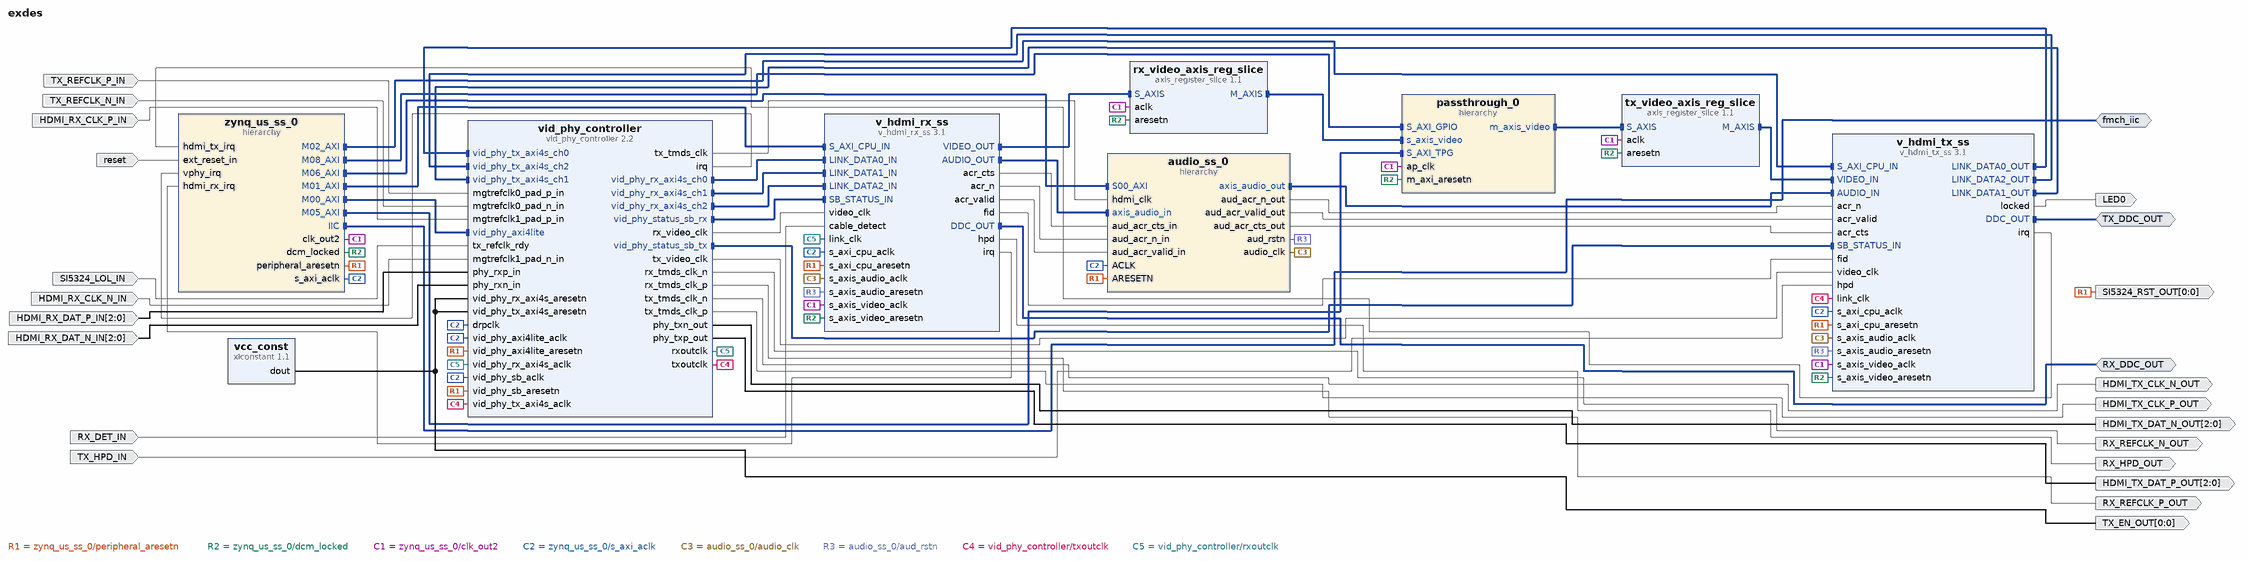
[diagram p0: block diagram of the top level]
# Vivado block design exdes, xczu9eg-ffvb1156-2-i-es2, Vivado 2018.2
create_bd_design exdes

create_bd_intf_port -mode Master -vlnv xilinx.com:interface:iic_rtl:1.0 fmch_iic
create_bd_intf_port -mode Master -vlnv xilinx.com:interface:iic_rtl:1.0 TX_DDC_OUT
create_bd_intf_port -mode Master -vlnv xilinx.com:interface:iic_rtl:1.0 RX_DDC_OUT
create_bd_port -dir I -type rst reset
set_property -dict {CONFIG.POLARITY ACTIVE_HIGH} [get_bd_ports reset]
create_bd_port -dir I TX_HPD_IN
create_bd_port -dir I TX_REFCLK_P_IN
create_bd_port -dir I TX_REFCLK_N_IN
create_bd_port -dir O HDMI_TX_CLK_P_OUT
create_bd_port -dir O HDMI_TX_CLK_N_OUT
create_bd_port -dir O -from 2 -to 0 HDMI_TX_DAT_P_OUT
create_bd_port -dir O -from 2 -to 0 HDMI_TX_DAT_N_OUT
create_bd_port -dir O -from 0 -to 0 TX_EN_OUT
create_bd_port -dir I RX_DET_IN
create_bd_port -dir I HDMI_RX_CLK_P_IN
create_bd_port -dir I HDMI_RX_CLK_N_IN
create_bd_port -dir I -from 2 -to 0 HDMI_RX_DAT_P_IN
create_bd_port -dir I -from 2 -to 0 HDMI_RX_DAT_N_IN
create_bd_port -dir O RX_HPD_OUT
create_bd_port -dir O RX_REFCLK_P_OUT
create_bd_port -dir O RX_REFCLK_N_OUT
create_bd_port -dir O -from 0 -to 0 SI5324_RST_OUT
create_bd_port -dir I SI5324_LOL_IN
create_bd_port -dir O LED0

create_bd_cell -type ip -vlnv xilinx.com:ip:vid_phy_controller:2.2 vid_phy_controller
set_property -dict [list \
  CONFIG.CHANNEL_SITE X0Y4 \
  CONFIG.C_Tx_Protocol HDMI \
  CONFIG.C_Rx_Protocol HDMI \
  CONFIG.C_TX_REFCLK_SEL 0 \
  CONFIG.C_RX_REFCLK_SEL 1 \
  CONFIG.C_TX_PLL_SELECTION 6 \
  CONFIG.C_RX_PLL_SELECTION 0 \
  CONFIG.C_NIDRU false \
  CONFIG.C_INPUT_PIXELS_PER_CLOCK 2 \
  CONFIG.C_Txrefclk_Rdy_Invert true \
  CONFIG.C_INT_HDMI_VER_CMPTBLE 3 \
] [get_bd_cells vid_phy_controller]
create_bd_cell -type ip -vlnv xilinx.com:ip:xlconstant:1.1 vcc_const
set_property -dict {CONFIG.CONST_VAL 1} [get_bd_cells vcc_const]
create_bd_cell -type ip -vlnv xilinx.com:ip:axis_register_slice:1.1 tx_video_axis_reg_slice
create_bd_cell -type ip -vlnv xilinx.com:ip:v_hdmi_tx_ss:3.1 v_hdmi_tx_ss
set_property -dict [list \
  CONFIG.C_INCLUDE_HDCP_1_4 false \
  CONFIG.C_INCLUDE_HDCP_2_2 false \
  CONFIG.C_MAX_BITS_PER_COMPONENT 8 \
  CONFIG.C_INPUT_PIXELS_PER_CLOCK 2 \
  CONFIG.C_HYSTERESIS_LEVEL 12 \
  CONFIG.C_ADDR_WIDTH 10 \
  CONFIG.C_INCLUDE_LOW_RESO_VID false \
  CONFIG.C_VID_INTERFACE 0 \
  CONFIG.C_INCLUDE_YUV420_SUP false \
  CONFIG.C_VALIDATION_ENABLE false \
  CONFIG.C_HDMI_FAST_SWITCH true \
  CONFIG.C_HPD_INVERT false \
  CONFIG.C_HDMI_VERSION 3 \
  CONFIG.C_ADD_MARK_DBG false \
] [get_bd_cells v_hdmi_tx_ss]
create_bd_cell -type ip -vlnv xilinx.com:ip:v_hdmi_rx_ss:3.1 v_hdmi_rx_ss
set_property -dict [list \
  CONFIG.C_INCLUDE_HDCP_1_4 false \
  CONFIG.C_INCLUDE_HDCP_2_2 false \
  CONFIG.C_MAX_BITS_PER_COMPONENT 8 \
  CONFIG.C_INPUT_PIXELS_PER_CLOCK 2 \
  CONFIG.C_EDID_RAM_SIZE 256 \
  CONFIG.C_ADDR_WIDTH 10 \
  CONFIG.C_INCLUDE_LOW_RESO_VID false \
  CONFIG.C_VID_INTERFACE 0 \
  CONFIG.C_INCLUDE_YUV420_SUP false \
  CONFIG.C_VALIDATION_ENABLE false \
  CONFIG.C_HDMI_FAST_SWITCH true \
  CONFIG.C_HPD_INVERT false \
  CONFIG.C_CD_INVERT true \
  CONFIG.C_EXDES_TOPOLOGY 0 \
  CONFIG.C_EXDES_TX_PLL_SELECTION 6 \
  CONFIG.C_EXDES_RX_PLL_SELECTION 0 \
  CONFIG.C_EXDES_NIDRU false \
  CONFIG.C_HDMI_VERSION 3 \
  CONFIG.C_ADD_MARK_DBG false \
  CONFIG.C_EXDES_AXILITE_FREQ 100 \
] [get_bd_cells v_hdmi_rx_ss]
create_bd_cell -type ip -vlnv xilinx.com:ip:axis_register_slice:1.1 rx_video_axis_reg_slice
create_bd_cell -type hier passthrough_0
create_bd_cell -type hier audio_ss_0
create_bd_cell -type hier zynq_us_ss_0

# ---- hierarchy /passthrough_0 ----
current_bd_instance /passthrough_0
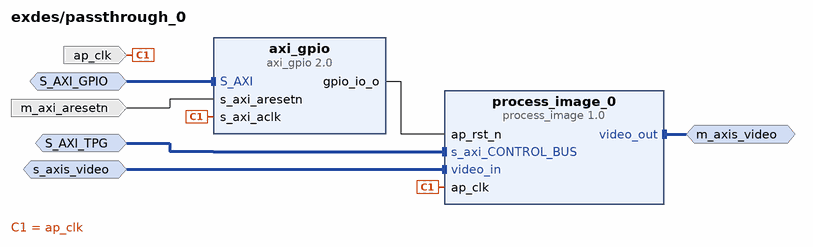
[diagram p1: block diagram inside /passthrough_0]
create_bd_intf_pin -mode Slave -vlnv xilinx.com:interface:aximm_rtl:1.0 S_AXI_TPG
create_bd_intf_pin -mode Slave -vlnv xilinx.com:interface:aximm_rtl:1.0 S_AXI_GPIO
create_bd_intf_pin -mode Slave -vlnv xilinx.com:interface:axis_rtl:1.0 s_axis_video
create_bd_intf_pin -mode Master -vlnv xilinx.com:interface:axis_rtl:1.0 m_axis_video
create_bd_pin -dir I -type clk ap_clk
create_bd_pin -dir I -type rst m_axi_aresetn

create_bd_cell -type ip -vlnv xilinx.com:ip:axi_gpio:2.0 axi_gpio
set_property -dict {CONFIG.C_GPIO_WIDTH 1 CONFIG.C_ALL_OUTPUTS 1} [get_bd_cells axi_gpio]
create_bd_cell -type ip -vlnv xilinx.com:hls:process_image:1.0 process_image_0

# ---- hierarchy /audio_ss_0 ----
current_bd_instance /audio_ss_0
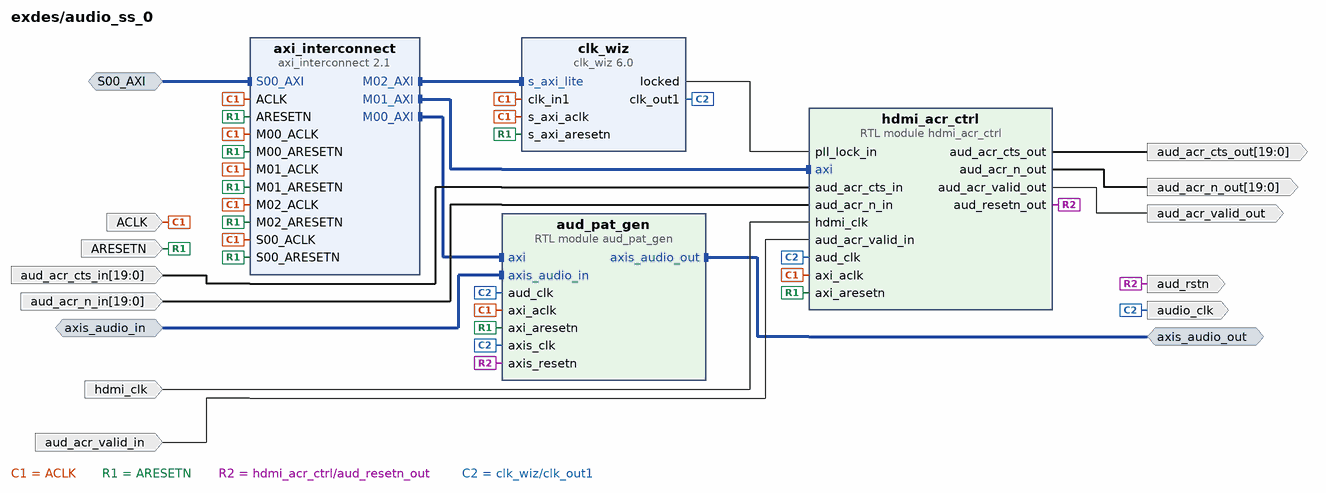
[diagram p2: block diagram inside /audio_ss_0]
create_bd_intf_pin -mode Slave -vlnv xilinx.com:interface:aximm_rtl:1.0 S00_AXI
create_bd_intf_pin -mode Slave -vlnv xilinx.com:interface:axis_rtl:1.0 axis_audio_in
create_bd_intf_pin -mode Master -vlnv xilinx.com:interface:axis_rtl:1.0 axis_audio_out
create_bd_pin -dir I -type clk ACLK
create_bd_pin -dir I -type rst ARESETN
create_bd_pin -dir I -type clk hdmi_clk
create_bd_pin -dir I -from 19 -to 0 aud_acr_cts_in
create_bd_pin -dir I -from 19 -to 0 aud_acr_n_in
create_bd_pin -dir I aud_acr_valid_in
create_bd_pin -dir O -from 19 -to 0 aud_acr_cts_out
create_bd_pin -dir O -from 19 -to 0 aud_acr_n_out
create_bd_pin -dir O aud_acr_valid_out
create_bd_pin -dir O -type rst aud_rstn
create_bd_pin -dir O -type clk audio_clk

create_bd_cell -type ip -vlnv xilinx.com:ip:axi_interconnect:2.1 axi_interconnect
set_property -dict {CONFIG.NUM_MI 3} [get_bd_cells axi_interconnect]
create_bd_cell -type ip -vlnv xilinx.com:ip:clk_wiz:6.0 clk_wiz
set_property -dict {CONFIG.USE_DYN_RECONFIG true CONFIG.PRIM_SOURCE No_buffer} [get_bd_cells clk_wiz]
create_bd_cell -type module -reference aud_pat_gen aud_pat_gen
create_bd_cell -type module -reference hdmi_acr_ctrl hdmi_acr_ctrl

# ---- hierarchy /zynq_us_ss_0 ----
current_bd_instance /zynq_us_ss_0
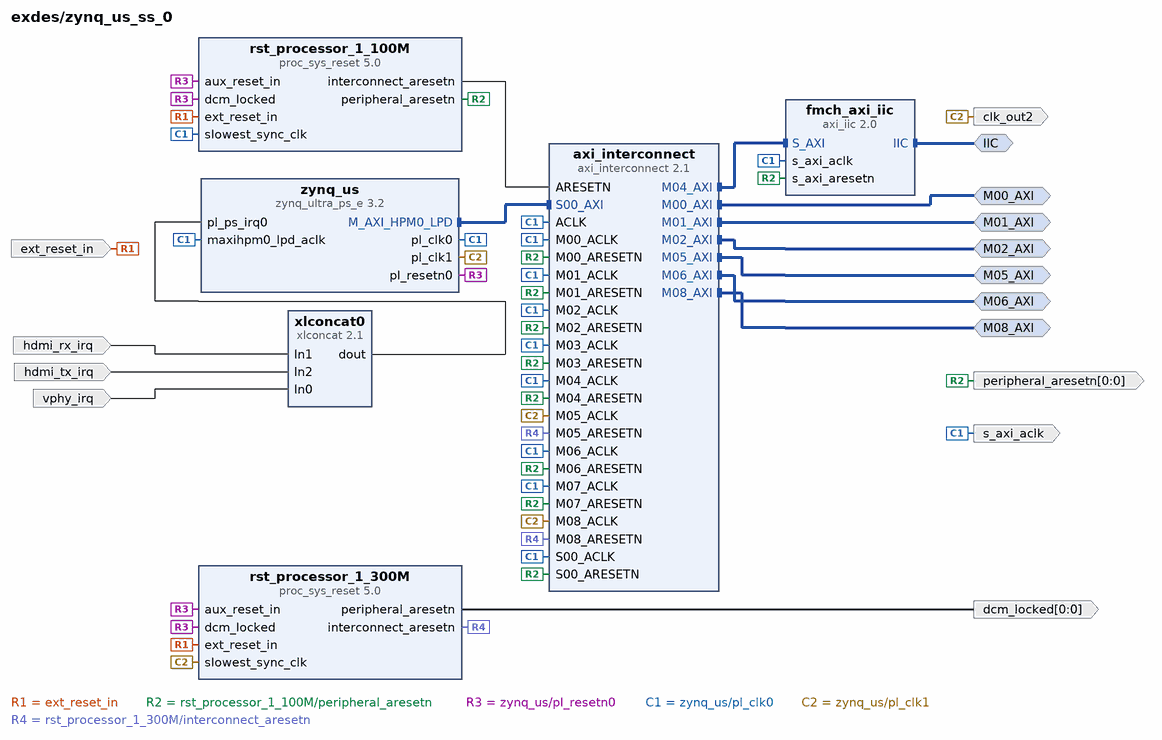
[diagram p3: block diagram inside /zynq_us_ss_0]
create_bd_intf_pin -mode Master -vlnv xilinx.com:interface:iic_rtl:1.0 IIC
create_bd_intf_pin -mode Master -vlnv xilinx.com:interface:aximm_rtl:1.0 M00_AXI
create_bd_intf_pin -mode Master -vlnv xilinx.com:interface:aximm_rtl:1.0 M01_AXI
create_bd_intf_pin -mode Master -vlnv xilinx.com:interface:aximm_rtl:1.0 M02_AXI
create_bd_intf_pin -mode Master -vlnv xilinx.com:interface:aximm_rtl:1.0 M05_AXI
create_bd_intf_pin -mode Master -vlnv xilinx.com:interface:aximm_rtl:1.0 M06_AXI
create_bd_intf_pin -mode Master -vlnv xilinx.com:interface:aximm_rtl:1.0 M08_AXI
create_bd_pin -dir I -type rst ext_reset_in
create_bd_pin -dir I hdmi_rx_irq
create_bd_pin -dir I hdmi_tx_irq
create_bd_pin -dir I vphy_irq
create_bd_pin -dir O -type clk clk_out2
create_bd_pin -dir O -from 0 -to 0 dcm_locked
create_bd_pin -dir O -from 0 -to 0 -type rst peripheral_aresetn
create_bd_pin -dir O -type clk s_axi_aclk

create_bd_cell -type ip -vlnv xilinx.com:ip:axi_interconnect:2.1 axi_interconnect
set_property -dict {CONFIG.NUM_MI 9} [get_bd_cells axi_interconnect]
create_bd_cell -type ip -vlnv xilinx.com:ip:xlconcat:2.1 xlconcat0
set_property -dict {CONFIG.NUM_PORTS 3} [get_bd_cells xlconcat0]
create_bd_cell -type ip -vlnv xilinx.com:ip:zynq_ultra_ps_e:3.2 zynq_us
set_property -dict [list \
  CONFIG.PSU__PSS_REF_CLK__FREQMHZ 33.330 \
  CONFIG.PSU__CAN1__PERIPHERAL__ENABLE 1 \
  CONFIG.PSU__CAN1__PERIPHERAL__IO {MIO 24 .. 25} \
  CONFIG.PSU__DPAUX__PERIPHERAL__ENABLE 1 \
  CONFIG.PSU__DPAUX__PERIPHERAL__IO {MIO 27 .. 30} \
  CONFIG.PSU__GEM__TSU__ENABLE 0 \
  CONFIG.PSU__FPGA_PL0_ENABLE 1 \
  CONFIG.PSU__FPGA_PL1_ENABLE 1 \
  CONFIG.PSU__ENET3__PERIPHERAL__ENABLE 1 \
  CONFIG.PSU__ENET3__FIFO__ENABLE 0 \
  CONFIG.PSU__ENET3__PTP__ENABLE 0 \
  CONFIG.PSU__ENET3__PERIPHERAL__IO {MIO 64 .. 75} \
  CONFIG.PSU__ENET3__GRP_MDIO__ENABLE 1 \
  CONFIG.PSU__ENET3__GRP_MDIO__IO {MIO 76 .. 77} \
  CONFIG.PSU__GPIO0_MIO__PERIPHERAL__ENABLE 1 \
  CONFIG.PSU__GPIO0_MIO__IO {MIO 0 .. 25} \
  CONFIG.PSU__GPIO1_MIO__PERIPHERAL__ENABLE 1 \
  CONFIG.PSU__GPIO1_MIO__IO {MIO 26 .. 51} \
  CONFIG.PSU__I2C0__PERIPHERAL__ENABLE 1 \
  CONFIG.PSU__I2C0__PERIPHERAL__IO {MIO 14 .. 15} \
  CONFIG.PSU__I2C1__PERIPHERAL__ENABLE 1 \
  CONFIG.PSU__I2C1__PERIPHERAL__IO {MIO 16 .. 17} \
  CONFIG.PSU__PCIE__PERIPHERAL__ENABLE 1 \
  CONFIG.PSU__PCIE__PERIPHERAL__ENDPOINT_ENABLE 0 \
  CONFIG.PSU__PCIE__PERIPHERAL__ROOTPORT_ENABLE 1 \
  CONFIG.PSU__PCIE__PERIPHERAL__ROOTPORT_IO {MIO 31} \
  CONFIG.PSU__PCIE__LANE0__ENABLE 1 \
  CONFIG.PSU__PCIE__LANE0__IO {GT Lane0} \
  CONFIG.PSU__GT__LINK_SPEED HBR \
  CONFIG.PSU__GT__VLT_SWNG_LVL_4 0 \
  CONFIG.PSU__GT__PRE_EMPH_LVL_4 0 \
  CONFIG.PSU__USB0__REF_CLK_SEL {Ref Clk2} \
  CONFIG.PSU__USB0__REF_CLK_FREQ 26 \
  CONFIG.PSU__DP__REF_CLK_SEL {Ref Clk3} \
  CONFIG.PSU__DP__REF_CLK_FREQ 27 \
  CONFIG.PSU__SATA__REF_CLK_SEL {Ref Clk1} \
  CONFIG.PSU__SATA__REF_CLK_FREQ 125 \
  CONFIG.PSU__PCIE__REF_CLK_SEL {Ref Clk0} \
  CONFIG.PSU__PCIE__REF_CLK_FREQ 100 \
  CONFIG.PSU__DP__LANE_SEL {Single Lower} \
  CONFIG.PSU__PCIE__DEVICE_PORT_TYPE {Root Port} \
  CONFIG.PSU__PCIE__MAXIMUM_LINK_WIDTH x1 \
  CONFIG.PSU__PCIE__LINK_SPEED {5.0 Gb/s} \
  CONFIG.PSU__PCIE__BAR0_VAL 0x0 \
  CONFIG.PSU__PCIE__BAR1_VAL 0x0 \
  CONFIG.PSU__PCIE__BAR2_VAL 0x0 \
  CONFIG.PSU__PCIE__BAR3_VAL 0x0 \
  CONFIG.PSU__PCIE__BAR4_VAL 0x0 \
  CONFIG.PSU__PCIE__BAR5_VAL 0x0 \
  CONFIG.PSU__PCIE__EROM_VAL 0x0 \
  CONFIG.PSU__PCIE__MAX_PAYLOAD_SIZE {256 bytes} \
  CONFIG.PSU__PCIE__VENDOR_ID 0x10EE \
  CONFIG.PSU__PCIE__DEVICE_ID 0xD021 \
  CONFIG.PSU__PCIE__REVISION_ID 0x0 \
  CONFIG.PSU__PCIE__SUBSYSTEM_VENDOR_ID 0x10EE \
  CONFIG.PSU__PCIE__SUBSYSTEM_ID 0x7 \
  CONFIG.PSU__PCIE__CLASS_CODE_BASE 0x06 \
  CONFIG.PSU__PCIE__CLASS_CODE_SUB 0x4 \
  CONFIG.PSU__PCIE__CLASS_CODE_INTERFACE 0x0 \
  CONFIG.PSU__PCIE__CLASS_CODE_VALUE 0x60400 \
  CONFIG.PSU__PCIE__CRS_SW_VISIBILITY 1 \
  CONFIG.SUBPRESET1 Custom \
  CONFIG.PSU__PMU__AIBACK__ENABLE 0 \
  CONFIG.PSU__PMU__PLERROR__ENABLE 0 \
  CONFIG.PSU__PMU__PERIPHERAL__ENABLE 1 \
  CONFIG.PSU__PMU__EMIO_GPI__ENABLE 0 \
  CONFIG.PSU__PMU__EMIO_GPO__ENABLE 0 \
  CONFIG.PSU__PMU__GPI0__ENABLE 0 \
  CONFIG.PSU__PMU__GPI1__ENABLE 0 \
  CONFIG.PSU__PMU__GPI2__ENABLE 0 \
  CONFIG.PSU__PMU__GPI3__ENABLE 0 \
  CONFIG.PSU__PMU__GPI4__ENABLE 0 \
  CONFIG.PSU__PMU__GPI5__ENABLE 0 \
  CONFIG.PSU__PMU__GPO0__ENABLE 1 \
  CONFIG.PSU__PMU__GPO1__ENABLE 1 \
  CONFIG.PSU__PMU__GPO2__ENABLE 1 \
  CONFIG.PSU__PMU__GPO3__ENABLE 1 \
  CONFIG.PSU__PMU__GPO4__ENABLE 1 \
  CONFIG.PSU__PMU__GPO5__ENABLE 1 \
  CONFIG.PSU__PMU__GPO0__IO {MIO 32} \
  CONFIG.PSU__PMU__GPO1__IO {MIO 33} \
  CONFIG.PSU__PMU__GPO2__IO {MIO 34} \
  CONFIG.PSU__PMU__GPO3__IO {MIO 35} \
  CONFIG.PSU__PMU__GPO4__IO {MIO 36} \
  CONFIG.PSU__PMU__GPO5__IO {MIO 37} \
  CONFIG.PSU__PMU__GPO2__POLARITY low \
  CONFIG.PSU__PMU__GPO3__POLARITY low \
  CONFIG.PSU__PMU__GPO4__POLARITY low \
  CONFIG.PSU__PMU__GPO5__POLARITY low \
  CONFIG.PSU__QSPI__PERIPHERAL__ENABLE 1 \
  CONFIG.PSU__QSPI__PERIPHERAL__IO {MIO 0 .. 12} \
  CONFIG.PSU__QSPI__PERIPHERAL__MODE {Dual Parallel} \
  CONFIG.PSU__QSPI__PERIPHERAL__DATA_MODE x4 \
  CONFIG.PSU__QSPI__GRP_FBCLK__ENABLE 1 \
  CONFIG.PSU__QSPI__GRP_FBCLK__IO {MIO 6} \
  CONFIG.PSU__SD1__PERIPHERAL__ENABLE 1 \
  CONFIG.PSU__SD1__PERIPHERAL__IO {MIO 39 .. 51} \
  CONFIG.PSU__SD1__GRP_CD__ENABLE 1 \
  CONFIG.PSU__SD1__GRP_CD__IO {MIO 45} \
  CONFIG.PSU__SD1__GRP_POW__ENABLE 1 \
  CONFIG.PSU__SD1__GRP_POW__IO {MIO 43} \
  CONFIG.PSU__SD1__GRP_WP__ENABLE 1 \
  CONFIG.PSU__SD1__GRP_WP__IO {MIO 44} \
  CONFIG.PSU__SD1__SLOT_TYPE {SD 3.0} \
  CONFIG.PSU__SD1__DATA_TRANSFER_MODE 8Bit \
  CONFIG.PSU__SWDT0__PERIPHERAL__ENABLE 1 \
  CONFIG.PSU__SWDT0__CLOCK__ENABLE 0 \
  CONFIG.PSU__SWDT0__RESET__ENABLE 0 \
  CONFIG.PSU__SWDT1__PERIPHERAL__ENABLE 1 \
  CONFIG.PSU__SWDT1__CLOCK__ENABLE 0 \
  CONFIG.PSU__SWDT1__RESET__ENABLE 0 \
  CONFIG.PSU__UART0__BAUD_RATE 115200 \
  CONFIG.PSU__TTC0__PERIPHERAL__ENABLE 1 \
  CONFIG.PSU__TTC0__CLOCK__ENABLE 0 \
  CONFIG.PSU__TTC0__WAVEOUT__ENABLE 0 \
  CONFIG.PSU__TTC1__PERIPHERAL__ENABLE 1 \
  CONFIG.PSU__UART1__BAUD_RATE 115200 \
  CONFIG.PSU__TTC1__CLOCK__ENABLE 0 \
  CONFIG.PSU__TTC1__WAVEOUT__ENABLE 0 \
  CONFIG.PSU__TTC2__PERIPHERAL__ENABLE 1 \
  CONFIG.PSU__TTC2__CLOCK__ENABLE 0 \
  CONFIG.PSU__TTC2__WAVEOUT__ENABLE 0 \
  CONFIG.PSU__TTC3__PERIPHERAL__ENABLE 1 \
  CONFIG.PSU__TTC3__CLOCK__ENABLE 0 \
  CONFIG.PSU__TTC3__WAVEOUT__ENABLE 0 \
  CONFIG.PSU__CSUPMU__PERIPHERAL__VALID 1 \
  CONFIG.PSU__DDRC__BUS_WIDTH {64 Bit} \
  CONFIG.PSU__DDRC__DEVICE_CAPACITY {4096 MBits} \
  CONFIG.PSU__DDRC__DRAM_WIDTH {8 Bits} \
  CONFIG.PSU__DDRC__ECC Disabled \
  CONFIG.PSU__DDRC__MEMORY_TYPE {DDR 4} \
  CONFIG.PSU__DDRC__SPEED_BIN DDR4_2133P \
  CONFIG.PSU__DDRC__COMPONENTS UDIMM \
  CONFIG.PSU__UART0__PERIPHERAL__ENABLE 1 \
  CONFIG.PSU__UART0__PERIPHERAL__IO {MIO 18 .. 19} \
  CONFIG.PSU__UART0__MODEM__ENABLE 0 \
  CONFIG.PSU__UART1__PERIPHERAL__ENABLE 1 \
  CONFIG.PSU__UART1__PERIPHERAL__IO {MIO 20 .. 21} \
  CONFIG.PSU__UART1__MODEM__ENABLE 0 \
  CONFIG.PSU__USB0__PERIPHERAL__ENABLE 1 \
  CONFIG.PSU__USB0__PERIPHERAL__IO {MIO 52 .. 63} \
  CONFIG.PSU__USB3_0__PERIPHERAL__ENABLE 1 \
  CONFIG.PSU__USB3_0__PERIPHERAL__IO {GT Lane2} \
  CONFIG.PSU__USB3_0__EMIO__ENABLE 0 \
  CONFIG.PSU__USB2_0__EMIO__ENABLE 0 \
  CONFIG.PSU__USE__M_AXI_GP0 0 \
  CONFIG.PSU__USE__M_AXI_GP1 0 \
  CONFIG.PSU__USE__M_AXI_GP2 1 \
  CONFIG.PSU__USE__IRQ0 1 \
  CONFIG.PSU__USE__IRQ1 1 \
  CONFIG.PSU__DDR_HIGH_ADDRESS_GUI_ENABLE 1 \
  CONFIG.PSU_BANK_0_IO_STANDARD LVCMOS18 \
  CONFIG.PSU_BANK_1_IO_STANDARD LVCMOS18 \
  CONFIG.PSU_BANK_2_IO_STANDARD LVCMOS18 \
  CONFIG.PSU__DISPLAYPORT__PERIPHERAL__ENABLE 1 \
  CONFIG.PSU__DISPLAYPORT__LANE0__ENABLE 1 \
  CONFIG.PSU__DISPLAYPORT__LANE0__IO {GT Lane1} \
  CONFIG.PSU__DISPLAYPORT__LANE1__ENABLE 0 \
  CONFIG.PSU__SATA__PERIPHERAL__ENABLE 1 \
  CONFIG.PSU__SATA__LANE1__IO {GT Lane3} \
  CONFIG.PSU__CRL_APB__USB3__ENABLE 1 \
  CONFIG.PSU__CRF_APB__APLL_CTRL__SRCSEL PSS_REF_CLK \
  CONFIG.PSU__CRF_APB__DPLL_CTRL__SRCSEL PSS_REF_CLK \
  CONFIG.PSU__CRF_APB__VPLL_CTRL__SRCSEL PSS_REF_CLK \
  CONFIG.PSU__CRF_APB__ACPU_CTRL__SRCSEL APLL \
  CONFIG.PSU__CRF_APB__DBG_TRACE_CTRL__SRCSEL IOPLL \
  CONFIG.PSU__CRF_APB__DBG_FPD_CTRL__SRCSEL IOPLL \
  CONFIG.PSU__CRF_APB__DP_VIDEO_REF_CTRL__SRCSEL VPLL \
  CONFIG.PSU__CRF_APB__DP_AUDIO_REF_CTRL__SRCSEL RPLL \
  CONFIG.PSU__CRF_APB__DP_STC_REF_CTRL__SRCSEL RPLL \
  CONFIG.PSU__CRF_APB__DDR_CTRL__SRCSEL DPLL \
  CONFIG.PSU__CRF_APB__GPU_REF_CTRL__SRCSEL IOPLL \
  CONFIG.PSU__CRL_APB__PL0_REF_CTRL__SRCSEL RPLL \
  CONFIG.PSU__CRF_APB__GDMA_REF_CTRL__SRCSEL APLL \
  CONFIG.PSU__CRF_APB__DPDMA_REF_CTRL__SRCSEL APLL \
  CONFIG.PSU__CRF_APB__TOPSW_MAIN_CTRL__SRCSEL DPLL \
  CONFIG.PSU__CRF_APB__TOPSW_LSBUS_CTRL__SRCSEL IOPLL \
  CONFIG.PSU__CRF_APB__DBG_TSTMP_CTRL__SRCSEL IOPLL \
  CONFIG.PSU__CRL_APB__IOPLL_CTRL__SRCSEL PSS_REF_CLK \
  CONFIG.PSU__CRL_APB__RPLL_CTRL__SRCSEL PSS_REF_CLK \
  CONFIG.PSU__CRL_APB__GEM3_REF_CTRL__SRCSEL IOPLL \
  CONFIG.PSU__CRL_APB__USB0_BUS_REF_CTRL__SRCSEL IOPLL \
  CONFIG.PSU__CRL_APB__QSPI_REF_CTRL__SRCSEL IOPLL \
  CONFIG.PSU__CRL_APB__SDIO1_REF_CTRL__SRCSEL IOPLL \
  CONFIG.PSU__CRL_APB__UART0_REF_CTRL__SRCSEL IOPLL \
  CONFIG.PSU__CRL_APB__UART1_REF_CTRL__SRCSEL IOPLL \
  CONFIG.PSU__CRL_APB__I2C0_REF_CTRL__SRCSEL IOPLL \
  CONFIG.PSU__CRL_APB__I2C1_REF_CTRL__SRCSEL IOPLL \
  CONFIG.PSU__CRL_APB__CAN1_REF_CTRL__SRCSEL IOPLL \
  CONFIG.PSU__CRL_APB__CPU_R5_CTRL__SRCSEL RPLL \
  CONFIG.PSU__CRL_APB__IOU_SWITCH_CTRL__SRCSEL IOPLL \
  CONFIG.PSU__CRL_APB__PCAP_CTRL__SRCSEL IOPLL \
  CONFIG.PSU__CRL_APB__LPD_LSBUS_CTRL__SRCSEL IOPLL \
  CONFIG.PSU__CRL_APB__LPD_SWITCH_CTRL__SRCSEL IOPLL \
  CONFIG.PSU__CRL_APB__DBG_LPD_CTRL__SRCSEL IOPLL \
  CONFIG.PSU__CRL_APB__ADMA_REF_CTRL__SRCSEL IOPLL \
  CONFIG.PSU__CRL_APB__TIMESTAMP_REF_CTRL__SRCSEL IOPLL \
  CONFIG.PSU__CRL_APB__USB3_DUAL_REF_CTRL__SRCSEL IOPLL \
  CONFIG.PSU__IOU_SLCR__IOU_TTC_APB_CLK__TTC0_SEL APB \
  CONFIG.PSU__IOU_SLCR__IOU_TTC_APB_CLK__TTC1_SEL APB \
  CONFIG.PSU__IOU_SLCR__IOU_TTC_APB_CLK__TTC2_SEL APB \
  CONFIG.PSU__IOU_SLCR__IOU_TTC_APB_CLK__TTC3_SEL APB \
  CONFIG.PSU__OVERRIDE__BASIC_CLOCK 0 \
  CONFIG.PSU__DLL__ISUSED 1 \
  CONFIG.PSU__DDR__INTERFACE__FREQMHZ 533.500 \
  CONFIG.PSU__CRF_APB__ACPU_CTRL__FREQMHZ 1200 \
  CONFIG.PSU__CRF_APB__DBG_TRACE_CTRL__FREQMHZ 250 \
  CONFIG.PSU__CRF_APB__DBG_FPD_CTRL__FREQMHZ 250 \
  CONFIG.PSU__CRF_APB__DDR_CTRL__FREQMHZ 1067 \
  CONFIG.PSU__CRF_APB__GPU_REF_CTRL__FREQMHZ 500 \
  CONFIG.PSU__CRL_APB__PL0_REF_CTRL__FREQMHZ 100 \
  CONFIG.PSU__CRF_APB__GDMA_REF_CTRL__FREQMHZ 600 \
  CONFIG.PSU__CRF_APB__DPDMA_REF_CTRL__FREQMHZ 600 \
  CONFIG.PSU__CRF_APB__TOPSW_MAIN_CTRL__FREQMHZ 533.33 \
  CONFIG.PSU__CRF_APB__TOPSW_LSBUS_CTRL__FREQMHZ 100 \
  CONFIG.PSU__CRF_APB__DBG_TSTMP_CTRL__FREQMHZ 250 \
  CONFIG.PSU__CRL_APB__GEM3_REF_CTRL__FREQMHZ 125 \
  CONFIG.PSU__CRL_APB__USB0_BUS_REF_CTRL__FREQMHZ 250 \
  CONFIG.PSU__CRL_APB__QSPI_REF_CTRL__FREQMHZ 125 \
  CONFIG.PSU__CRL_APB__SDIO1_REF_CTRL__FREQMHZ 200 \
  CONFIG.PSU__CRL_APB__UART0_REF_CTRL__FREQMHZ 100 \
  CONFIG.PSU__CRL_APB__UART1_REF_CTRL__FREQMHZ 100 \
  CONFIG.PSU__CRL_APB__I2C0_REF_CTRL__FREQMHZ 100 \
  CONFIG.PSU__CRL_APB__I2C1_REF_CTRL__FREQMHZ 100 \
  CONFIG.PSU__CRL_APB__CAN1_REF_CTRL__FREQMHZ 100 \
  CONFIG.PSU__CRL_APB__CPU_R5_CTRL__FREQMHZ 500 \
  CONFIG.PSU__CRL_APB__IOU_SWITCH_CTRL__FREQMHZ 250 \
  CONFIG.PSU__CRL_APB__PCAP_CTRL__FREQMHZ 200 \
  CONFIG.PSU__CRL_APB__LPD_LSBUS_CTRL__FREQMHZ 100 \
  CONFIG.PSU__CRL_APB__LPD_SWITCH_CTRL__FREQMHZ 500 \
  CONFIG.PSU__CRL_APB__DBG_LPD_CTRL__FREQMHZ 250 \
  CONFIG.PSU__CRL_APB__ADMA_REF_CTRL__FREQMHZ 500 \
  CONFIG.PSU__CRL_APB__TIMESTAMP_REF_CTRL__FREQMHZ 100 \
  CONFIG.PSU__CRL_APB__USB3_DUAL_REF_CTRL__FREQMHZ 20 \
  CONFIG.PSU__PMU_COHERENCY 0 \
  CONFIG.PSU__USB0_COHERENCY 0 \
  CONFIG.PSU__SD1_COHERENCY 0 \
  CONFIG.PSU__QSPI_COHERENCY 0 \
  CONFIG.PSU__ENET3__TSU__ENABLE 0 \
  CONFIG.PSU__GEM3_COHERENCY 0 \
] [get_bd_cells zynq_us]
# 103 more settings of zynq_us are not shown: defaults, MIO pin electricals, DDR timing, and values the tool derives
create_bd_cell -type ip -vlnv xilinx.com:ip:axi_iic:2.0 fmch_axi_iic
set_property -dict {CONFIG.USE_BOARD_FLOW true CONFIG.IIC_BOARD_INTERFACE Custom} [get_bd_cells fmch_axi_iic]
create_bd_cell -type ip -vlnv xilinx.com:ip:proc_sys_reset:5.0 rst_processor_1_100M
set_property -dict {CONFIG.USE_BOARD_FLOW true CONFIG.RESET_BOARD_INTERFACE reset} [get_bd_cells rst_processor_1_100M]
create_bd_cell -type ip -vlnv xilinx.com:ip:proc_sys_reset:5.0 rst_processor_1_300M
set_property -dict {CONFIG.USE_BOARD_FLOW true CONFIG.RESET_BOARD_INTERFACE reset} [get_bd_cells rst_processor_1_300M]

# ---- connections ----

current_bd_instance /passthrough_0
connect_bd_intf_net [get_bd_intf_pins S_AXI_TPG] [get_bd_intf_pins process_image_0/s_axi_CONTROL_BUS]
connect_bd_intf_net -intf_net intf_net_bdry_in_S_AXI_GPIO [get_bd_intf_pins S_AXI_GPIO] [get_bd_intf_pins axi_gpio/S_AXI]
connect_bd_intf_net [get_bd_intf_pins s_axis_video] [get_bd_intf_pins process_image_0/video_in]
connect_bd_intf_net [get_bd_intf_pins m_axis_video] [get_bd_intf_pins process_image_0/video_out]
connect_bd_net -net net_bdry_in_ap_clk [get_bd_pins ap_clk] [get_bd_pins axi_gpio/s_axi_aclk] [get_bd_pins process_image_0/ap_clk]
connect_bd_net -net net_bdry_in_m_axi_aresetn [get_bd_pins m_axi_aresetn] [get_bd_pins axi_gpio/s_axi_aresetn]
connect_bd_net -net net_axi_gpio_gpio_io_o [get_bd_pins axi_gpio/gpio_io_o] [get_bd_pins process_image_0/ap_rst_n]

current_bd_instance /audio_ss_0
connect_bd_intf_net -intf_net intf_net_axi_interconnect_M00_AXI [get_bd_intf_pins axi_interconnect/M00_AXI] [get_bd_intf_pins aud_pat_gen/axi]
connect_bd_intf_net -intf_net intf_net_axi_interconnect_M01_AXI [get_bd_intf_pins axi_interconnect/M01_AXI] [get_bd_intf_pins hdmi_acr_ctrl/axi]
connect_bd_intf_net -intf_net intf_net_axi_interconnect_M02_AXI [get_bd_intf_pins axi_interconnect/M02_AXI] [get_bd_intf_pins clk_wiz/s_axi_lite]
connect_bd_intf_net -intf_net intf_net_bdry_in_S00_AXI [get_bd_intf_pins S00_AXI] [get_bd_intf_pins axi_interconnect/S00_AXI]
connect_bd_intf_net -intf_net intf_net_bdry_in_axis_audio_in [get_bd_intf_pins axis_audio_in] [get_bd_intf_pins aud_pat_gen/axis_audio_in]
connect_bd_intf_net -intf_net intf_net_aud_pat_gen_axis_audio_out [get_bd_intf_pins axis_audio_out] [get_bd_intf_pins aud_pat_gen/axis_audio_out]
connect_bd_net -net net_bdry_in_ACLK [get_bd_pins ACLK] \
  [get_bd_pins axi_interconnect/ACLK] [get_bd_pins aud_pat_gen/axi_aclk] [get_bd_pins hdmi_acr_ctrl/axi_aclk] \
  [get_bd_pins clk_wiz/s_axi_aclk] [get_bd_pins clk_wiz/clk_in1] [get_bd_pins axi_interconnect/S00_ACLK] \
  [get_bd_pins axi_interconnect/M00_ACLK] [get_bd_pins axi_interconnect/M01_ACLK] [get_bd_pins axi_interconnect/M02_ACLK]
connect_bd_net -net net_bdry_in_aud_acr_cts_in [get_bd_pins aud_acr_cts_in] [get_bd_pins hdmi_acr_ctrl/aud_acr_cts_in]
connect_bd_net -net net_bdry_in_aud_acr_n_in [get_bd_pins aud_acr_n_in] [get_bd_pins hdmi_acr_ctrl/aud_acr_n_in]
connect_bd_net -net net_bdry_in_hdmi_clk [get_bd_pins hdmi_clk] [get_bd_pins hdmi_acr_ctrl/hdmi_clk]
connect_bd_net -net net_bdry_in_aud_acr_valid_in [get_bd_pins aud_acr_valid_in] [get_bd_pins hdmi_acr_ctrl/aud_acr_valid_in]
connect_bd_net -net net_bdry_in_ARESETN [get_bd_pins ARESETN] \
  [get_bd_pins axi_interconnect/ARESETN] [get_bd_pins aud_pat_gen/axi_aresetn] [get_bd_pins hdmi_acr_ctrl/axi_aresetn] \
  [get_bd_pins clk_wiz/s_axi_aresetn] [get_bd_pins axi_interconnect/S00_ARESETN] [get_bd_pins axi_interconnect/M00_ARESETN] \
  [get_bd_pins axi_interconnect/M01_ARESETN] [get_bd_pins axi_interconnect/M02_ARESETN]
connect_bd_net -net net_hdmi_acr_ctrl_aud_acr_cts_out [get_bd_pins hdmi_acr_ctrl/aud_acr_cts_out] [get_bd_pins aud_acr_cts_out]
connect_bd_net -net net_hdmi_acr_ctrl_aud_acr_n_out [get_bd_pins hdmi_acr_ctrl/aud_acr_n_out] [get_bd_pins aud_acr_n_out]
connect_bd_net -net net_hdmi_acr_ctrl_aud_acr_valid_out [get_bd_pins hdmi_acr_ctrl/aud_acr_valid_out] [get_bd_pins aud_acr_valid_out]
connect_bd_net -net net_hdmi_acr_ctrl_aud_resetn_out [get_bd_pins hdmi_acr_ctrl/aud_resetn_out] \
  [get_bd_pins aud_rstn] [get_bd_pins aud_pat_gen/axis_resetn]
connect_bd_net -net net_clk_wiz_clk_out1 [get_bd_pins clk_wiz/clk_out1] \
  [get_bd_pins audio_clk] [get_bd_pins aud_pat_gen/axis_clk] [get_bd_pins aud_pat_gen/aud_clk] \
  [get_bd_pins hdmi_acr_ctrl/aud_clk]
connect_bd_net -net net_clk_wiz_locked [get_bd_pins clk_wiz/locked] [get_bd_pins hdmi_acr_ctrl/pll_lock_in]

current_bd_instance /zynq_us_ss_0
connect_bd_intf_net -intf_net intf_net_zynq_us_M_AXI_HPM0_LPD [get_bd_intf_pins zynq_us/M_AXI_HPM0_LPD] [get_bd_intf_pins axi_interconnect/S00_AXI]
connect_bd_intf_net -intf_net intf_net_axi_interconnect_M04_AXI [get_bd_intf_pins axi_interconnect/M04_AXI] [get_bd_intf_pins fmch_axi_iic/S_AXI]
connect_bd_intf_net -intf_net intf_net_fmch_axi_iic_IIC [get_bd_intf_pins IIC] [get_bd_intf_pins fmch_axi_iic/IIC]
connect_bd_intf_net -intf_net intf_net_axi_interconnect_M00_AXI [get_bd_intf_pins M00_AXI] [get_bd_intf_pins axi_interconnect/M00_AXI]
connect_bd_intf_net -intf_net intf_net_axi_interconnect_M01_AXI [get_bd_intf_pins M01_AXI] [get_bd_intf_pins axi_interconnect/M01_AXI]
connect_bd_intf_net -intf_net intf_net_axi_interconnect_M02_AXI [get_bd_intf_pins M02_AXI] [get_bd_intf_pins axi_interconnect/M02_AXI]
connect_bd_intf_net -intf_net intf_net_axi_interconnect_M05_AXI [get_bd_intf_pins M05_AXI] [get_bd_intf_pins axi_interconnect/M05_AXI]
connect_bd_intf_net -intf_net intf_net_axi_interconnect_M06_AXI [get_bd_intf_pins M06_AXI] [get_bd_intf_pins axi_interconnect/M06_AXI]
connect_bd_intf_net -intf_net intf_net_axi_interconnect_M08_AXI [get_bd_intf_pins M08_AXI] [get_bd_intf_pins axi_interconnect/M08_AXI]
connect_bd_net -net net_bdry_in_ext_reset_in [get_bd_pins ext_reset_in] \
  [get_bd_pins rst_processor_1_100M/ext_reset_in] [get_bd_pins rst_processor_1_300M/ext_reset_in]
connect_bd_net -net net_bdry_in_hdmi_rx_irq [get_bd_pins hdmi_rx_irq] [get_bd_pins xlconcat0/In1]
connect_bd_net -net net_bdry_in_hdmi_tx_irq [get_bd_pins hdmi_tx_irq] [get_bd_pins xlconcat0/In2]
connect_bd_net -net net_bdry_in_vphy_irq [get_bd_pins vphy_irq] [get_bd_pins xlconcat0/In0]
connect_bd_net -net net_xlconcat0_dout [get_bd_pins xlconcat0/dout] [get_bd_pins zynq_us/pl_ps_irq0]
connect_bd_net -net net_rst_processor_1_100M_interconnect_aresetn [get_bd_pins rst_processor_1_100M/interconnect_aresetn] \
  [get_bd_pins axi_interconnect/ARESETN]
connect_bd_net -net net_rst_processor_1_100M_peripheral_aresetn [get_bd_pins rst_processor_1_100M/peripheral_aresetn] \
  [get_bd_pins fmch_axi_iic/s_axi_aresetn] [get_bd_pins axi_interconnect/S00_ARESETN] [get_bd_pins peripheral_aresetn] \
  [get_bd_pins axi_interconnect/M00_ARESETN] [get_bd_pins axi_interconnect/M01_ARESETN] \
  [get_bd_pins axi_interconnect/M02_ARESETN] [get_bd_pins axi_interconnect/M03_ARESETN] \
  [get_bd_pins axi_interconnect/M04_ARESETN] [get_bd_pins axi_interconnect/M06_ARESETN] \
  [get_bd_pins axi_interconnect/M07_ARESETN]
connect_bd_net -net net_zynq_us_pl_resetn0 [get_bd_pins zynq_us/pl_resetn0] \
  [get_bd_pins rst_processor_1_100M/aux_reset_in] [get_bd_pins rst_processor_1_100M/dcm_locked] \
  [get_bd_pins rst_processor_1_300M/aux_reset_in] [get_bd_pins rst_processor_1_300M/dcm_locked]
connect_bd_net -net net_zynq_us_pl_clk0 [get_bd_pins zynq_us/pl_clk0] \
  [get_bd_pins rst_processor_1_100M/slowest_sync_clk] [get_bd_pins zynq_us/maxihpm0_lpd_aclk] \
  [get_bd_pins fmch_axi_iic/s_axi_aclk] [get_bd_pins axi_interconnect/S00_ACLK] [get_bd_pins s_axi_aclk] \
  [get_bd_pins axi_interconnect/ACLK] [get_bd_pins axi_interconnect/M00_ACLK] [get_bd_pins axi_interconnect/M01_ACLK] \
  [get_bd_pins axi_interconnect/M02_ACLK] [get_bd_pins axi_interconnect/M03_ACLK] [get_bd_pins axi_interconnect/M04_ACLK] \
  [get_bd_pins axi_interconnect/M06_ACLK] [get_bd_pins axi_interconnect/M07_ACLK]
connect_bd_net -net net_zynq_us_pl_clk1 [get_bd_pins zynq_us/pl_clk1] \
  [get_bd_pins rst_processor_1_300M/slowest_sync_clk] [get_bd_pins axi_interconnect/M05_ACLK] \
  [get_bd_pins axi_interconnect/M08_ACLK] [get_bd_pins clk_out2]
connect_bd_net -net net_rst_processor_1_300M_peripheral_aresetn [get_bd_pins rst_processor_1_300M/peripheral_aresetn] [get_bd_pins dcm_locked]
connect_bd_net -net net_rst_processor_1_300M_interconnect_aresetn [get_bd_pins rst_processor_1_300M/interconnect_aresetn] \
  [get_bd_pins axi_interconnect/M05_ARESETN] [get_bd_pins axi_interconnect/M08_ARESETN]

current_bd_instance /
connect_bd_intf_net -intf_net intf_net_rx_video_axis_reg_slice_M_AXIS [get_bd_intf_pins rx_video_axis_reg_slice/M_AXIS] [get_bd_intf_pins passthrough_0/s_axis_video]
connect_bd_intf_net -intf_net intf_net_zynq_us_ss_0_M00_AXI [get_bd_intf_pins zynq_us_ss_0/M00_AXI] [get_bd_intf_pins vid_phy_controller/vid_phy_axi4lite]
connect_bd_intf_net -intf_net intf_net_zynq_us_ss_0_M02_AXI [get_bd_intf_pins zynq_us_ss_0/M02_AXI] [get_bd_intf_pins v_hdmi_tx_ss/S_AXI_CPU_IN]
connect_bd_intf_net -intf_net intf_net_zynq_us_ss_0_M06_AXI [get_bd_intf_pins zynq_us_ss_0/M06_AXI] [get_bd_intf_pins audio_ss_0/S00_AXI]
connect_bd_intf_net -intf_net intf_net_zynq_us_ss_0_M08_AXI [get_bd_intf_pins zynq_us_ss_0/M08_AXI] [get_bd_intf_pins passthrough_0/S_AXI_GPIO]
connect_bd_intf_net -intf_net intf_net_zynq_us_ss_0_M01_AXI [get_bd_intf_pins zynq_us_ss_0/M01_AXI] [get_bd_intf_pins v_hdmi_rx_ss/S_AXI_CPU_IN]
connect_bd_intf_net -intf_net intf_net_zynq_us_ss_0_M05_AXI [get_bd_intf_pins zynq_us_ss_0/M05_AXI] [get_bd_intf_pins passthrough_0/S_AXI_TPG]
connect_bd_intf_net -intf_net intf_net_v_tpg_ss_0_m_axis_video [get_bd_intf_pins passthrough_0/m_axis_video] [get_bd_intf_pins tx_video_axis_reg_slice/S_AXIS]
connect_bd_intf_net -intf_net intf_net_tx_video_axis_reg_slice_M_AXIS [get_bd_intf_pins tx_video_axis_reg_slice/M_AXIS] [get_bd_intf_pins v_hdmi_tx_ss/VIDEO_IN]
connect_bd_intf_net -intf_net intf_net_audio_ss_0_axis_audio_out [get_bd_intf_pins audio_ss_0/axis_audio_out] [get_bd_intf_pins v_hdmi_tx_ss/AUDIO_IN]
connect_bd_intf_net -intf_net intf_net_v_hdmi_tx_ss_LINK_DATA0_OUT [get_bd_intf_pins v_hdmi_tx_ss/LINK_DATA0_OUT] [get_bd_intf_pins vid_phy_controller/vid_phy_tx_axi4s_ch0]
connect_bd_intf_net -intf_net intf_net_v_hdmi_tx_ss_LINK_DATA2_OUT [get_bd_intf_pins v_hdmi_tx_ss/LINK_DATA2_OUT] [get_bd_intf_pins vid_phy_controller/vid_phy_tx_axi4s_ch2]
connect_bd_intf_net -intf_net intf_net_v_hdmi_tx_ss_LINK_DATA1_OUT [get_bd_intf_pins v_hdmi_tx_ss/LINK_DATA1_OUT] [get_bd_intf_pins vid_phy_controller/vid_phy_tx_axi4s_ch1]
connect_bd_intf_net -intf_net intf_net_vid_phy_controller_vid_phy_status_sb_tx [get_bd_intf_pins vid_phy_controller/vid_phy_status_sb_tx] [get_bd_intf_pins v_hdmi_tx_ss/SB_STATUS_IN]
connect_bd_intf_net -intf_net intf_net_vid_phy_controller_vid_phy_rx_axi4s_ch0 [get_bd_intf_pins vid_phy_controller/vid_phy_rx_axi4s_ch0] [get_bd_intf_pins v_hdmi_rx_ss/LINK_DATA0_IN]
connect_bd_intf_net -intf_net intf_net_vid_phy_controller_vid_phy_rx_axi4s_ch1 [get_bd_intf_pins vid_phy_controller/vid_phy_rx_axi4s_ch1] [get_bd_intf_pins v_hdmi_rx_ss/LINK_DATA1_IN]
connect_bd_intf_net -intf_net intf_net_vid_phy_controller_vid_phy_rx_axi4s_ch2 [get_bd_intf_pins vid_phy_controller/vid_phy_rx_axi4s_ch2] [get_bd_intf_pins v_hdmi_rx_ss/LINK_DATA2_IN]
connect_bd_intf_net -intf_net intf_net_vid_phy_controller_vid_phy_status_sb_rx [get_bd_intf_pins vid_phy_controller/vid_phy_status_sb_rx] [get_bd_intf_pins v_hdmi_rx_ss/SB_STATUS_IN]
connect_bd_intf_net -intf_net intf_net_v_hdmi_rx_ss_AUDIO_OUT [get_bd_intf_pins v_hdmi_rx_ss/AUDIO_OUT] [get_bd_intf_pins audio_ss_0/axis_audio_in]
connect_bd_intf_net -intf_net intf_net_v_hdmi_rx_ss_VIDEO_OUT [get_bd_intf_pins v_hdmi_rx_ss/VIDEO_OUT] [get_bd_intf_pins rx_video_axis_reg_slice/S_AXIS]
connect_bd_intf_net -intf_net intf_net_zynq_us_ss_0_IIC [get_bd_intf_ports fmch_iic] [get_bd_intf_pins zynq_us_ss_0/IIC]
connect_bd_intf_net -intf_net intf_net_v_hdmi_tx_ss_DDC_OUT [get_bd_intf_ports TX_DDC_OUT] [get_bd_intf_pins v_hdmi_tx_ss/DDC_OUT]
connect_bd_intf_net -intf_net intf_net_v_hdmi_rx_ss_DDC_OUT [get_bd_intf_ports RX_DDC_OUT] [get_bd_intf_pins v_hdmi_rx_ss/DDC_OUT]
connect_bd_net -net net_bdry_in_reset [get_bd_ports reset] [get_bd_pins zynq_us_ss_0/ext_reset_in]
connect_bd_net -net net_bdry_in_TX_REFCLK_P_IN [get_bd_ports TX_REFCLK_P_IN] [get_bd_pins vid_phy_controller/mgtrefclk0_pad_p_in]
connect_bd_net -net net_bdry_in_TX_REFCLK_N_IN [get_bd_ports TX_REFCLK_N_IN] [get_bd_pins vid_phy_controller/mgtrefclk0_pad_n_in]
connect_bd_net -net net_bdry_in_HDMI_RX_CLK_P_IN [get_bd_ports HDMI_RX_CLK_P_IN] [get_bd_pins vid_phy_controller/mgtrefclk1_pad_p_in]
connect_bd_net -net net_bdry_in_SI5324_LOL_IN [get_bd_ports SI5324_LOL_IN] [get_bd_pins vid_phy_controller/tx_refclk_rdy]
connect_bd_net -net net_bdry_in_HDMI_RX_CLK_N_IN [get_bd_ports HDMI_RX_CLK_N_IN] [get_bd_pins vid_phy_controller/mgtrefclk1_pad_n_in]
connect_bd_net -net net_bdry_in_HDMI_RX_DAT_P_IN [get_bd_ports HDMI_RX_DAT_P_IN] [get_bd_pins vid_phy_controller/phy_rxp_in]
connect_bd_net -net net_bdry_in_RX_DET_IN [get_bd_ports RX_DET_IN] [get_bd_pins v_hdmi_rx_ss/cable_detect]
connect_bd_net -net net_bdry_in_TX_HPD_IN [get_bd_ports TX_HPD_IN] [get_bd_pins v_hdmi_tx_ss/hpd]
connect_bd_net -net net_bdry_in_HDMI_RX_DAT_N_IN [get_bd_ports HDMI_RX_DAT_N_IN] [get_bd_pins vid_phy_controller/phy_rxn_in]
connect_bd_net -net net_zynq_us_ss_0_peripheral_aresetn [get_bd_pins zynq_us_ss_0/peripheral_aresetn] \
  [get_bd_pins audio_ss_0/ARESETN] [get_bd_pins v_hdmi_tx_ss/s_axi_cpu_aresetn] [get_bd_pins v_hdmi_rx_ss/s_axi_cpu_aresetn] \
  [get_bd_pins vid_phy_controller/vid_phy_sb_aresetn] [get_bd_pins vid_phy_controller/vid_phy_axi4lite_aresetn] \
  [get_bd_ports SI5324_RST_OUT]
connect_bd_net -net net_zynq_us_ss_0_dcm_locked [get_bd_pins zynq_us_ss_0/dcm_locked] \
  [get_bd_pins rx_video_axis_reg_slice/aresetn] [get_bd_pins passthrough_0/m_axi_aresetn] \
  [get_bd_pins tx_video_axis_reg_slice/aresetn] [get_bd_pins v_hdmi_tx_ss/s_axis_video_aresetn] \
  [get_bd_pins v_hdmi_rx_ss/s_axis_video_aresetn]
connect_bd_net -net net_zynq_us_ss_0_clk_out2 [get_bd_pins zynq_us_ss_0/clk_out2] \
  [get_bd_pins rx_video_axis_reg_slice/aclk] [get_bd_pins passthrough_0/ap_clk] [get_bd_pins tx_video_axis_reg_slice/aclk] \
  [get_bd_pins v_hdmi_tx_ss/s_axis_video_aclk] [get_bd_pins v_hdmi_rx_ss/s_axis_video_aclk]
connect_bd_net -net net_zynq_us_ss_0_s_axi_aclk [get_bd_pins zynq_us_ss_0/s_axi_aclk] \
  [get_bd_pins audio_ss_0/ACLK] [get_bd_pins v_hdmi_tx_ss/s_axi_cpu_aclk] [get_bd_pins v_hdmi_rx_ss/s_axi_cpu_aclk] \
  [get_bd_pins vid_phy_controller/vid_phy_sb_aclk] [get_bd_pins vid_phy_controller/vid_phy_axi4lite_aclk] \
  [get_bd_pins vid_phy_controller/drpclk]
connect_bd_net -net net_audio_ss_0_aud_acr_n_out [get_bd_pins audio_ss_0/aud_acr_n_out] [get_bd_pins v_hdmi_tx_ss/acr_n]
connect_bd_net -net net_audio_ss_0_audio_clk [get_bd_pins audio_ss_0/audio_clk] \
  [get_bd_pins v_hdmi_tx_ss/s_axis_audio_aclk] [get_bd_pins v_hdmi_rx_ss/s_axis_audio_aclk]
connect_bd_net -net net_audio_ss_0_aud_acr_valid_out [get_bd_pins audio_ss_0/aud_acr_valid_out] [get_bd_pins v_hdmi_tx_ss/acr_valid]
connect_bd_net -net net_audio_ss_0_aud_rstn [get_bd_pins audio_ss_0/aud_rstn] \
  [get_bd_pins v_hdmi_tx_ss/s_axis_audio_aresetn] [get_bd_pins v_hdmi_rx_ss/s_axis_audio_aresetn]
connect_bd_net -net net_audio_ss_0_aud_acr_cts_out [get_bd_pins audio_ss_0/aud_acr_cts_out] [get_bd_pins v_hdmi_tx_ss/acr_cts]
connect_bd_net -net net_v_hdmi_tx_ss_locked [get_bd_pins v_hdmi_tx_ss/locked] [get_bd_ports LED0]
connect_bd_net -net net_v_hdmi_tx_ss_irq [get_bd_pins v_hdmi_tx_ss/irq] [get_bd_pins zynq_us_ss_0/hdmi_tx_irq]
connect_bd_net -net net_vid_phy_controller_tx_tmds_clk [get_bd_pins vid_phy_controller/tx_tmds_clk] [get_bd_pins audio_ss_0/hdmi_clk]
connect_bd_net -net net_vid_phy_controller_rx_tmds_clk_n [get_bd_pins vid_phy_controller/rx_tmds_clk_n] [get_bd_ports RX_REFCLK_N_OUT]
connect_bd_net -net net_vid_phy_controller_rx_tmds_clk_p [get_bd_pins vid_phy_controller/rx_tmds_clk_p] [get_bd_ports RX_REFCLK_P_OUT]
connect_bd_net -net net_vid_phy_controller_tx_tmds_clk_n [get_bd_pins vid_phy_controller/tx_tmds_clk_n] [get_bd_ports HDMI_TX_CLK_N_OUT]
connect_bd_net -net net_vid_phy_controller_tx_video_clk [get_bd_pins vid_phy_controller/tx_video_clk] [get_bd_pins v_hdmi_tx_ss/video_clk]
connect_bd_net -net net_vid_phy_controller_tx_tmds_clk_p [get_bd_pins vid_phy_controller/tx_tmds_clk_p] [get_bd_ports HDMI_TX_CLK_P_OUT]
connect_bd_net -net net_vid_phy_controller_irq [get_bd_pins vid_phy_controller/irq] [get_bd_pins zynq_us_ss_0/vphy_irq]
connect_bd_net -net net_vid_phy_controller_rx_video_clk [get_bd_pins vid_phy_controller/rx_video_clk] [get_bd_pins v_hdmi_rx_ss/video_clk]
connect_bd_net -net net_vid_phy_controller_txoutclk [get_bd_pins vid_phy_controller/txoutclk] \
  [get_bd_pins vid_phy_controller/vid_phy_tx_axi4s_aclk] [get_bd_pins v_hdmi_tx_ss/link_clk]
connect_bd_net -net net_vid_phy_controller_phy_txn_out [get_bd_pins vid_phy_controller/phy_txn_out] [get_bd_ports HDMI_TX_DAT_N_OUT]
connect_bd_net -net net_vid_phy_controller_phy_txp_out [get_bd_pins vid_phy_controller/phy_txp_out] [get_bd_ports HDMI_TX_DAT_P_OUT]
connect_bd_net -net net_vid_phy_controller_rxoutclk [get_bd_pins vid_phy_controller/rxoutclk] \
  [get_bd_pins vid_phy_controller/vid_phy_rx_axi4s_aclk] [get_bd_pins v_hdmi_rx_ss/link_clk]
connect_bd_net -net net_v_hdmi_rx_ss_fid [get_bd_pins v_hdmi_rx_ss/fid] [get_bd_pins v_hdmi_tx_ss/fid]
connect_bd_net -net net_v_hdmi_rx_ss_acr_cts [get_bd_pins v_hdmi_rx_ss/acr_cts] [get_bd_pins audio_ss_0/aud_acr_cts_in]
connect_bd_net -net net_v_hdmi_rx_ss_irq [get_bd_pins v_hdmi_rx_ss/irq] [get_bd_pins zynq_us_ss_0/hdmi_rx_irq]
connect_bd_net -net net_v_hdmi_rx_ss_acr_n [get_bd_pins v_hdmi_rx_ss/acr_n] [get_bd_pins audio_ss_0/aud_acr_n_in]
connect_bd_net -net net_v_hdmi_rx_ss_acr_valid [get_bd_pins v_hdmi_rx_ss/acr_valid] [get_bd_pins audio_ss_0/aud_acr_valid_in]
connect_bd_net -net net_v_hdmi_rx_ss_hpd [get_bd_pins v_hdmi_rx_ss/hpd] [get_bd_ports RX_HPD_OUT]
connect_bd_net -net net_vcc_const_dout [get_bd_pins vcc_const/dout] \
  [get_bd_ports TX_EN_OUT] [get_bd_pins vid_phy_controller/vid_phy_tx_axi4s_aresetn] \
  [get_bd_pins vid_phy_controller/vid_phy_rx_axi4s_aresetn]

# ---- address map ----
assign_bd_address -offset 0x00080000000 -range 64K -target_address_space [get_bd_addr_spaces zynq_us_ss_0/zynq_us/Data] [get_bd_addr_segs v_hdmi_rx_ss/S_AXI_CPU_IN/Reg]
assign_bd_address -offset 0x00080010000 -range 64K -target_address_space [get_bd_addr_spaces zynq_us_ss_0/zynq_us/Data] [get_bd_addr_segs audio_ss_0/clk_wiz/s_axi_lite/Reg]
assign_bd_address -offset 0x00080020000 -range 128K -target_address_space [get_bd_addr_spaces zynq_us_ss_0/zynq_us/Data] [get_bd_addr_segs v_hdmi_tx_ss/S_AXI_CPU_IN/Reg]
assign_bd_address -offset 0x00080040000 -range 4K -target_address_space [get_bd_addr_spaces zynq_us_ss_0/zynq_us/Data] [get_bd_addr_segs passthrough_0/axi_gpio/S_AXI/Reg]
assign_bd_address -offset 0x00080041000 -range 4K -target_address_space [get_bd_addr_spaces zynq_us_ss_0/zynq_us/Data] [get_bd_addr_segs zynq_us_ss_0/fmch_axi_iic/S_AXI/Reg]
assign_bd_address -offset 0x00080050000 -range 64K -target_address_space [get_bd_addr_spaces zynq_us_ss_0/zynq_us/Data] [get_bd_addr_segs passthrough_0/process_image_0/s_axi_CONTROL_BUS/Reg]
assign_bd_address -offset 0x00080060000 -range 64K -target_address_space [get_bd_addr_spaces zynq_us_ss_0/zynq_us/Data] [get_bd_addr_segs vid_phy_controller/vid_phy_axi4lite/Reg]
assign_bd_address -offset 0x00088000000 -range 64K -target_address_space [get_bd_addr_spaces zynq_us_ss_0/zynq_us/Data] [get_bd_addr_segs audio_ss_0/hdmi_acr_ctrl/axi/reg0]
assign_bd_address -offset 0x00090000000 -range 64K -target_address_space [get_bd_addr_spaces zynq_us_ss_0/zynq_us/Data] [get_bd_addr_segs audio_ss_0/aud_pat_gen/axi/reg0]

validate_bd_design
save_bd_design
